# Altium schematic sheet Sensors.SchDoc
size A
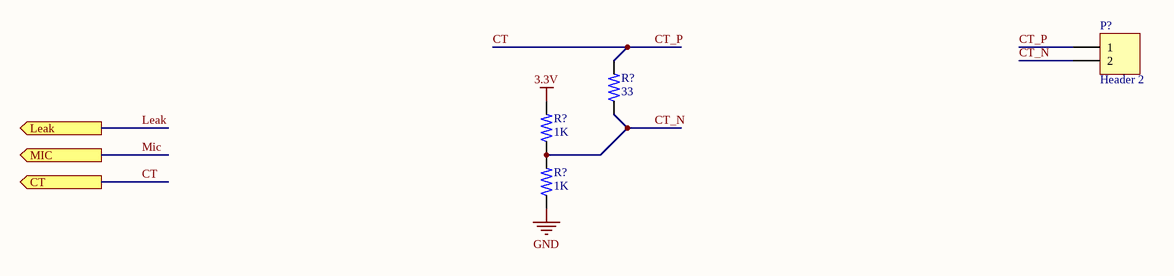
[diagram p0: Sensors.SchDoc]

## Parts
(Parts that share a designator on the sheet are numbered #1, #2 ... from top to bottom, then left to right.)
P?  Header 2  [HDR1X2]
R?#1  33  [RESC1608X06L - RES0603]
R?#2  1K  [RESC1608X06L - RES0603]
R?#3  1K  [RESC1608X06L - RES0603]

## Ports
CT (out), Leak (out), MIC (out)

## Nets
3.3V: R?#2.2
GND: R?#3.1
CT: P?.1 R?#1.2 ; port CT  [also labelled CT_P]
CT_N: P?.2 R?#1.1 R?#2.1 R?#3.2
Leak: port Leak
Mic: port MIC

## Library data of the parts
P? = Header 2: Header, 2-Pin; LatestRevisionDate: 17-Jul-2002; LatestRevisionNote: Re-released for DXP Platform.; Publisher: Altium Limited
R?#1 = RES0603 33 1% 1/10W: SMT 0603 Ceramic Resistor; Power: 1/10W; Tolerance: 1%; Value: 33; Supplier 1: Digi-Key; Supplier 2: Digi-Key; Supplier 3: Digi-Key; Supplier Part Number 1: 311-33.0HRCT-ND; Supplier Part Number 2: RMCF0603FT33R0CT-ND; Supplier Part Number 3: P33.0HCT-ND
R?#2 R?#3 = RES0603 1K 1% 1/10W: SMT 0603 Ceramic Resistor; Power: 1/10W; Tolerance: 1%; Value: 1K; Supplier 1: Digi-Key; Supplier 2: Digi-Key; Supplier 3: Digi-Key; Supplier Part Number 1: 311-1.00KHRCT-ND; Supplier Part Number 2: P1.00KHCT-ND; Supplier Part Number 3: RMCF0603FG1K00CT-ND